# Altium schematic sheet EPS_MPPT_X.SchDoc: MPPT-X
size A3
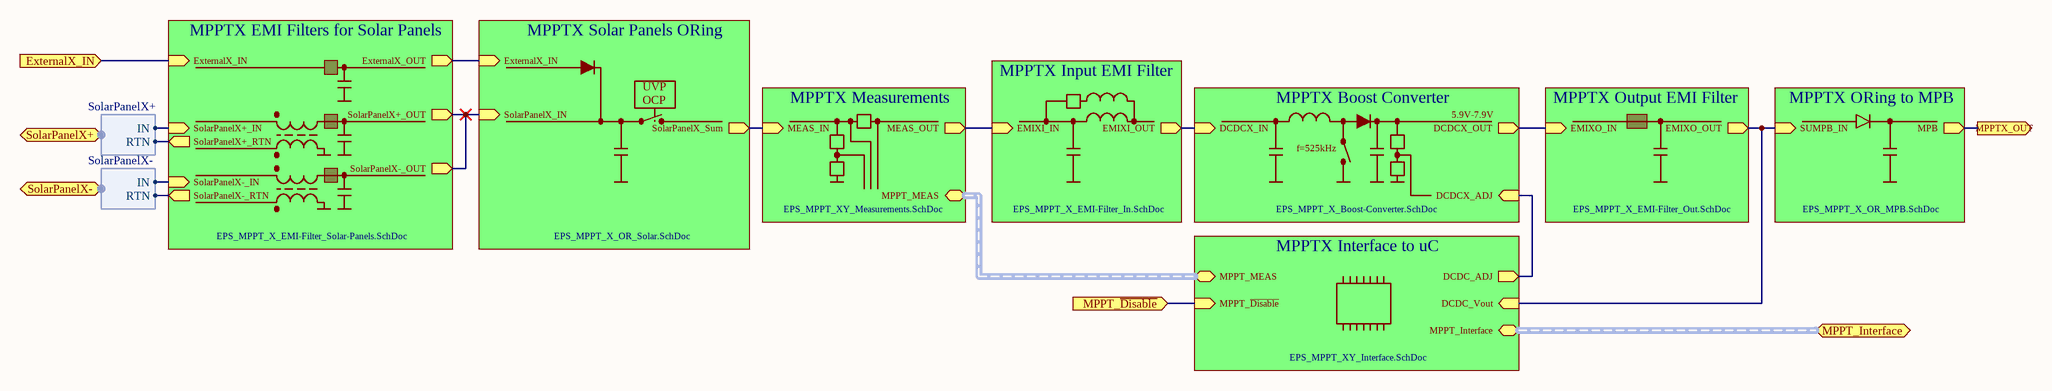
[diagram p0: EPS_MPPT_X.SchDoc]

## Sub-sheets
MPPTX Boost Converter = EPS_MPPT_X_Boost-Converter.SchDoc: DCDCX_IN (in), DCDCX_OUT (out), DCDCX_ADJ (in)
MPPTX EMI Filters for Solar Panels = EPS_MPPT_X_EMI-Filter_Solar-Panels.SchDoc: SolarPanelX+_RTN (out), SolarPanelX-_IN (in), ExternalX_IN (in), SolarPanelX-_RTN (out), SolarPanelX+_IN (in), ExternalX_OUT (out), SolarPanelX-_OUT (out), SolarPanelX+_OUT (out)
MPPTX Input EMI Filter = EPS_MPPT_X_EMI-Filter_In.SchDoc: EMIXI_OUT (out), EMIXI_IN (in)
MPPTX Interface to uC = EPS_MPPT_XY_Interface.SchDoc: MPPT_Interface (harness MPPT_Interface), DCDC_Vout (in), MPPT_MEAS (harness MPPT_MEAS), DCDC_ADJ (out), MPPT_~{Disable} (in)
MPPTX Measurements = EPS_MPPT_XY_Measurements.SchDoc: MEAS_IN (in), MEAS_OUT (out), MPPT_MEAS (harness MPPT_MEAS)
MPPTX ORing to MPB = EPS_MPPT_X_OR_MPB.SchDoc: MPB (out), SUMPB_IN (in)
MPPTX Output EMI Filter = EPS_MPPT_X_EMI-Filter_Out.SchDoc: EMIXO_OUT (out), EMIXO_IN (in)
MPPTX Solar Panels ORing = EPS_MPPT_X_OR_Solar.SchDoc: ExternalX_IN (in), SolarPanelX_Sum (out), SolarPanelX_IN (in)

## Ports
ExternalX_IN (in), MPPT_Interface (harness MPPT_Interface), MPPT_~{Disable} (in), MPPTX_OUT (out), SolarPanelX+ (harness SolarPanelX+), SolarPanelX- (harness SolarPanelX-)

## Harnesses
SolarPanelX+: IN, RTN
SolarPanelX-: IN, RTN

## Nets
ExternalX_IN: port ExternalX_IN, sheet MPPTX EMI Filters for Solar Panels/ExternalX_IN
MPPT_~{Disable}: port MPPT_~{Disable}, sheet MPPTX Interface to uC/MPPT_~{Disable}
MPPTX_OUT: port MPPTX_OUT, sheet MPPTX ORing to MPB/MPB
(unnamed): sheet MPPTX Boost Converter/DCDCX_IN, sheet MPPTX Input EMI Filter/EMIXI_OUT
(unnamed): sheet MPPTX Boost Converter/DCDCX_OUT, sheet MPPTX Output EMI Filter/EMIXO_IN
(unnamed): sheet MPPTX Boost Converter/DCDCX_ADJ, sheet MPPTX Interface to uC/DCDC_ADJ
(unnamed): sheet MPPTX Solar Panels ORing/ExternalX_IN, sheet MPPTX EMI Filters for Solar Panels/ExternalX_OUT
(unnamed): sheet MPPTX Solar Panels ORing/SolarPanelX_Sum, sheet MPPTX Measurements/MEAS_IN
(unnamed): sheet MPPTX Solar Panels ORing/SolarPanelX_IN, sheet MPPTX EMI Filters for Solar Panels/SolarPanelX-_OUT, sheet MPPTX EMI Filters for Solar Panels/SolarPanelX+_OUT
(unnamed): sheet MPPTX EMI Filters for Solar Panels/SolarPanelX+_RTN, port SolarPanelX+.RTN
(unnamed): sheet MPPTX EMI Filters for Solar Panels/SolarPanelX-_IN, port SolarPanelX-.IN
(unnamed): sheet MPPTX EMI Filters for Solar Panels/SolarPanelX-_RTN, port SolarPanelX-.RTN
(unnamed): sheet MPPTX EMI Filters for Solar Panels/SolarPanelX+_IN, port SolarPanelX+.IN
(unnamed): sheet MPPTX Interface to uC/DCDC_Vout, sheet MPPTX Output EMI Filter/EMIXO_OUT, sheet MPPTX ORing to MPB/SUMPB_IN
(unnamed): sheet MPPTX Measurements/MEAS_OUT, sheet MPPTX Input EMI Filter/EMIXI_IN

## Buses and harness runs
harness port MPPT_Interface = sheet MPPTX Interface to uC/MPPT_Interface
harness sheet MPPTX Interface to uC/MPPT_MEAS = sheet MPPTX Measurements/MPPT_MEAS

## Notes on the sheet
- UVP
- OCP
- f=525kHz
- 5.9V-7.9V
- Title:
- Project:
- Author:
- Model:
- Document Number:
- Checked by:
- Rev:
- Date:
- Approved by:
- Sheet:
- of
- File name: